# Altium schematic sheet GSM.SchDoc
size A4; SheetNumber: 6; SheetTotal: 8
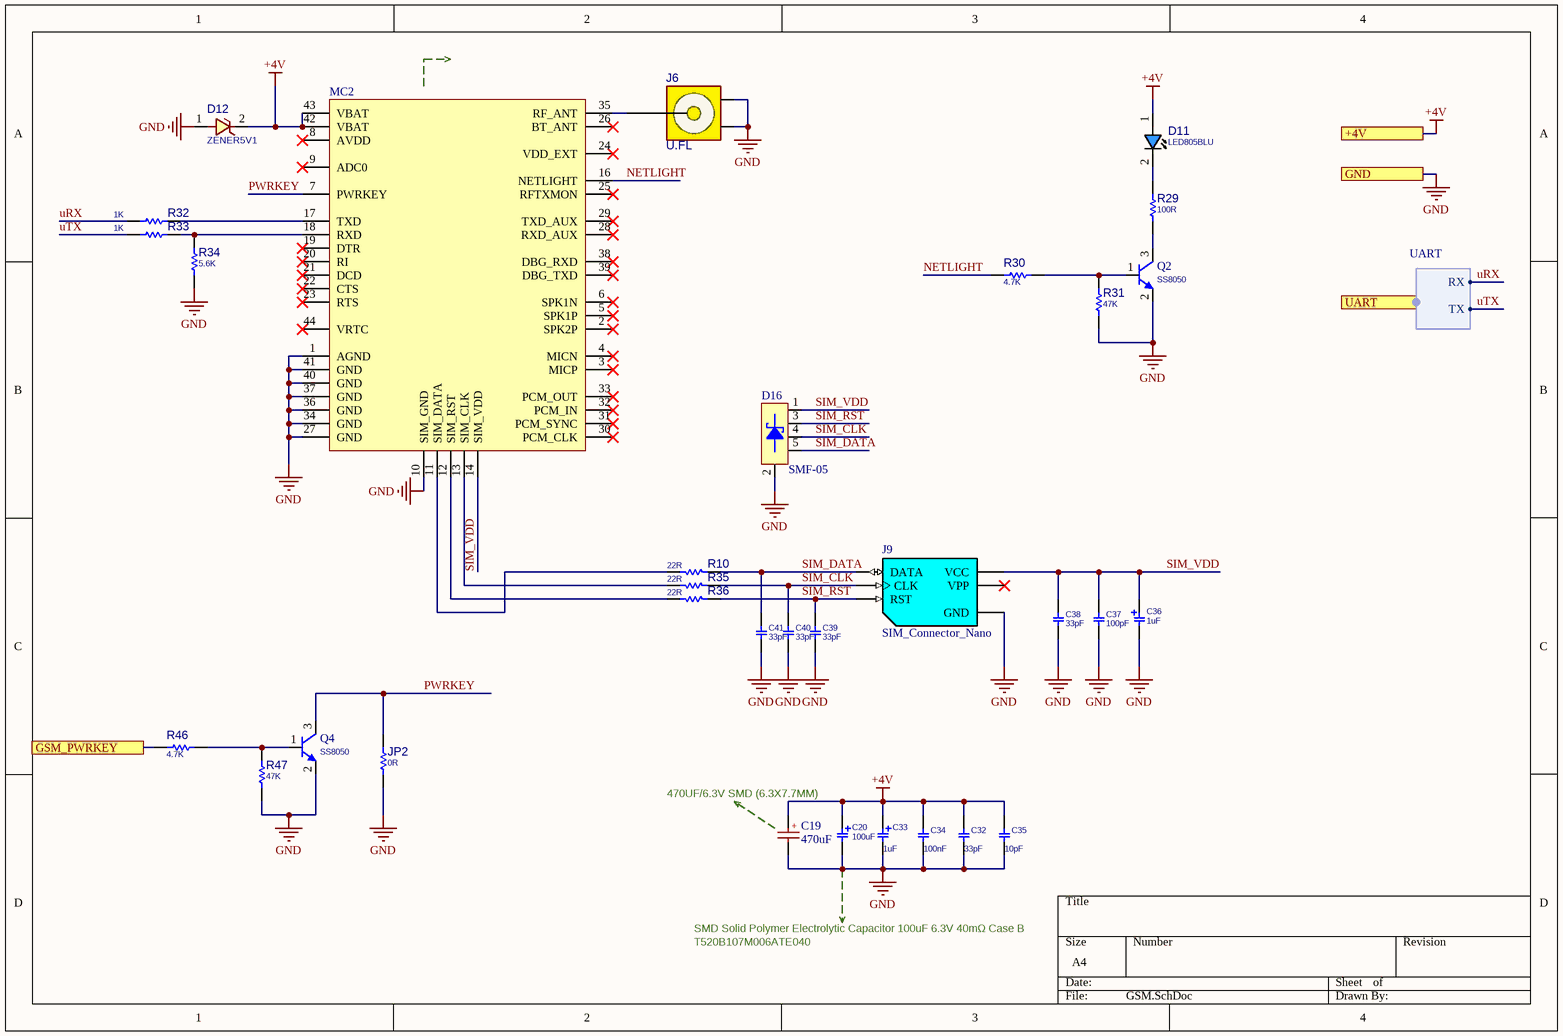
[diagram p0: GSM.SchDoc]

## Parts
C19  470uF  [Cap SMD 6.3x7.7mm]
C20  100uF  [C_TN_3528_BLK]
C32  33pF  [C0603]
C33  1uF  [C_TN_3216]
C34  100nF  [C0805]
C35  10pF  [C0603]
C36  1uF  [C_TN_3216]
C37  100pF  [C0805]
C38  33pF  [C0805]
C39  33pF  [C0805]
C40  33pF  [C0805]
C41  33pF  [C0805]
D11  LED805BLU  [LED0805BLU]
D12  ZENER5V1  [D_SOD123W]
D16  SMF-05  [SC70-5_N]
J6  U.FL  [UFL]
J9  SIM_Connector_Nano  [SIM_Connector_Nano]
JP2  0R  [R0805]
MC2  M66  [m66]  (value not drawn)
Q2  SS8050  [SOT23_3]
Q4  SS8050  [SOT23_3]
R10  22R  [R0805]
R29  100R  [R0805]
R30  4.7K  [R0805]
R31  47K  [R0805]
R32  1K  [R0805]
R33  1K  [R0805]
R34  5.6K  [R0805]
R35  22R  [R0805]
R36  22R  [R0805]
R46  4.7K  [R0805]
R47  47K  [R0805]

## Ports
+4V, GND, GSM_PWRKEY, UART (harness UART)

## Harnesses
UART: RX, TX

## Nets
+4V: C19.1(+) C20.1 C32.1 C33.1 C34.2 C35.1 D11.1(ANODE) D12.2 MC2.42(VBAT) MC2.43(VBAT) ; port +4V
GND: C19.2(-) C20.2 C32.2 C33.2 C34.1 C35.2 C36.2 C37.1 C38.1 C39.1 C40.1 C41.1 D12.1 D16.2(K) J6.2(G1) J6.3(G2) J9.C5(GND) JP2.1 MC2.1(AGND) MC2.10(SIM_GND) MC2.27(GND) MC2.34(GND) MC2.36(GND) MC2.37(GND) MC2.40(GND) MC2.41(GND) Q2.2(E) Q4.2(E) R31.1 R34.1 R47.1 ; port GND
GSM_PWRKEY: R46.1 ; port GSM_PWRKEY
NETLIGHT: MC2.16(NETLIGHT) R30.1
PWRKEY: JP2.2 MC2.7(PWRKEY) Q4.3(C)
SIM_CLK: C40.2 D16.4(K) J9.C3(CLK) R35.1
SIM_DATA: C41.2 D16.5(K) J9.C7(DATA) R10.1
SIM_RST: C39.2 D16.3(K) J9.C2(RST) R36.1
SIM_VDD: C36.1 C37.2 C38.2 D16.1(K) J9.C1(VCC) MC2.14(SIM_VDD)
uRX: R32.1 ; port UART.RX
uTX: R33.1 ; port UART.TX
NetD11_2: D11.2(CATHODE) R29.2
NetJ6_1: J6.1(SIG) MC2.35(RF_ANT)
NetMC2_11: MC2.11(SIM_DATA) R10.2
NetMC2_12: MC2.12(SIM_RST) R36.2
NetMC2_13: MC2.13(SIM_CLK) R35.2
NetMC2_17: MC2.17(TXD) R32.2
NetMC2_18: MC2.18(RXD) R33.2 R34.2
NetQ2_1: Q2.1(B) R30.2 R31.2
NetQ2_3: Q2.3(C) R29.1
NetQ4_1: Q4.1(B) R46.2 R47.2

Not connected (* = marked no-connect by the designer): J9 C6(VPP)*; MC2 2(SPK2P)* 3(MICP)* 4(MICN)* 5(SPK1P)* 6(SPK1N)* 8(AVDD)* 9(ADC0)* 19(DTR)* 20(RI)* 21(DCD)* 22(CTS)* 23(RTS)* 24(VDD_EXT)* 25(RFTXMON)* 26(BT_ANT)* 28(RXD_AUX)* 29(TXD_AUX)* 30(PCM_CLK)* 31(PCM_SYNC)* 32(PCM_IN)* 33(PCM_OUT)* 38(DBG_RXD)* 39(DBG_TXD)* 44(VRTC)*

## Notes on the sheet
- 470UF/6.3V SMD (6.3X7.7MM)
- SMD Solid Polymer Electrolytic Capacitor 100uF 6.3V 40mΩ Case B
- T520B107M006ATE040

## Library data of the parts
C19 = CAP Electrolytic SMD: SMD Aluminum Electrolytic Capacitor; Desc: SMD Aluminum Electrolytic Capacitors; Value: 100uF; Voltage: 12v; Tolerance: 5%; Library Link: https://github.com/Majid-Derhambakhsh; Publisher: Majid Derhambakhsh
C20 = CAP_SMD_TAN_4: CAP, SMD, TAN; PARAM: 20%, 300mOhm, -55~105oC; MANF: VISHAY; MANF_P#: T55A106M6R3C0300; PARAM2: 6.3V; PRICE: 0.46$; VALUE: 100uF
C32 C35 = CAP_SMD_MLCC_0603: CAP, MLCC, -F, -V, MATERIAL, -%, 0201; PARAM: -, -%; MANF_P#: MANF_PART#; PRICE: 100= 1$; MANF: -; PARAM2: -V; ASSEMBLY: ASSEMBLY
  C32: VALUE: 33pF
  C35: VALUE: 10pF
C33 C36 = CAP_SMD_TAN: CAP, SMD, TAN,; PARAM2: -V; VALUE: 1uF
C34 C37-C41 = CAP_SMD_MLCC_0805: CAP, MLCC, -F, -V, MATERIAL, -%, 0201; PARAM: -, -%; MANF_P#: MANF_PART#; PRICE: 100= 1$; MANF: -; PARAM2: -V; ASSEMBLY: ASSEMBLY
  C34: VALUE: 100nF
  C37: VALUE: 100pF
  C38-C41: VALUE: 33pF
D11 = LED_SMD_0805_BLU: LED, SMD, 0805, BLUE; DESC: DESCRIPTION; MANF_P#: MANF_PART#; PARAM2: 2.2V; MANF: MANF; ASSEMBLY: ASSEMBLY; PRICE: 36t@Javan; VALUE: LED805BLU
D12 = DIODE_SMD_ZENER_BZT52HC5V1: DIODE, ZENER, 1W, 5.1V; MANF: Diodes; DESC: DESCRIPTION; PARAM2: 1W, 4Ohm, -55~150oC; MANF_P#: BZT52HC5V1WF-7; ASSEMBLY: ASSEMBLY; PRICE: 0.25$; PARAM: 5.1V; VALUE: ZENER5V1
D16 = Semi_Diod_TVS_SMF05: TVS Diode Array; Rating: Rating?; Validation: Valid; Inflow: inflow?; Type: TVS; Value: SMF-05; Package: SC70-5
J6 = CONN_RF_UFL: CONN, RF, U.FL, STRAIGHT, Ultra Miniature Coaxial; MANF_P#: CONUFL001-SMD, U.FL-R-SMT-1(10), 128-0711-201; MANF: Linx, Hirose, Cinch; PARAM: 50Ohm, 6GHz; DESC: DESCRIPTION; DIST#: DIGIKEY, MOUSER; PARAM2: GOLD; ASSEMBLY: ASSEMBLY; PRICE: 0.9$; VALUE: U.FL
J9 = SIM_Connector_Nano: Nano SimCard Holder 6P
JP2 R10 R29-R36 R46 R47 = RES_SMD_0805: RESISTOR, SMD; PARAM: -W; DESC: DESCRIPTION; DIST#: MOUSER; PARAM2: 1%; MANF_P#: -; MANF: -; ASSEMBLY: ASSEMBLY; PRICE: 100= 0.5$
  JP2: VALUE: 0R
  R10 R35 R36: VALUE: 22R
  R29: VALUE: 100R
  R30 R46: VALUE: 4.7K
  R31 R47: VALUE: 47K
  R32 R33: VALUE: 1K
  R34: VALUE: 5.6K
MC2 = ModSen_Com_M66: Quectel GSM/GPRS Module; Rating: Rating?; Validation: Valid; Inflow: inflow?; Package: Dip; Value: M66; Type: GSM-GPRS
Q2 Q4 = NPN_SS8050_SOT23: BJT, NPN, 25v, 1.5A, SMD, SOT23; PARAM2: 300mW; MANF: GALAXY; PARAM: 25v, 1.5A; MANF_P#: SS8050; VALUE: SS8050